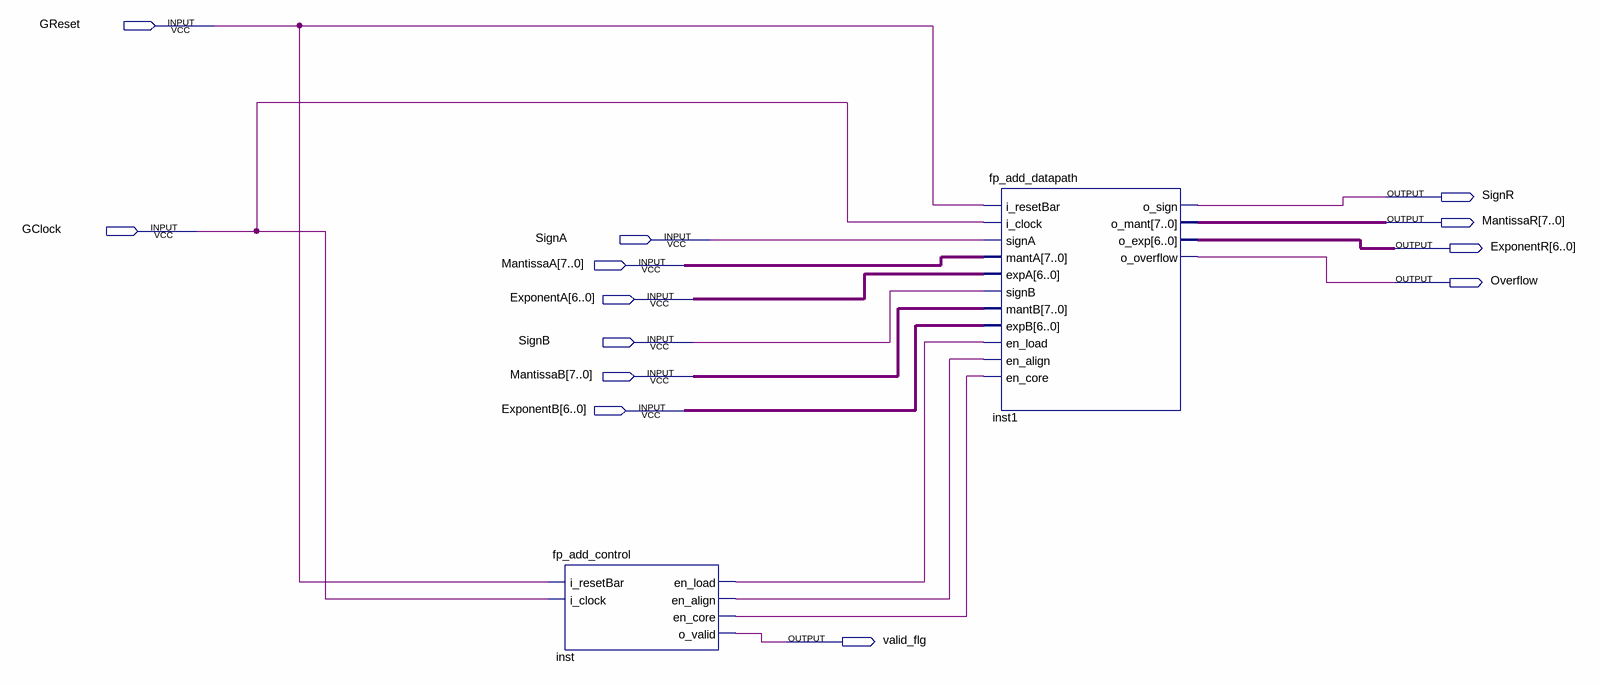
[diagram p0: schematic sheet]
// Quartus schematic top_level.bdf as structural Verilog: 2 symbols, 13 pins
module top_level (
  input  GReset,
  input  GClock,
  input  SignA,
  input  [7:0] MantissaA,
  input  [6:0] ExponentA,
  input  SignB,
  input  [7:0] MantissaB,
  input  [6:0] ExponentB,
  output SignR,
  output [7:0] MantissaR,
  output [6:0] ExponentR,
  output Overflow,
  output valid_flg
);

  wire inst_en_align, inst_en_core, inst_en_load;

  fp_add_control inst (
    .i_resetBar(GReset), .i_clock(GClock), .en_load(inst_en_load), .en_align(inst_en_align),
    .en_core(inst_en_core), .o_valid(valid_flg));
  fp_add_datapath inst1 (
    .i_resetBar(GReset), .i_clock(GClock), .signA(SignA), .mantA(MantissaA), .expA(ExponentA), .signB(SignB),
    .mantB(MantissaB), .expB(ExponentB), .en_load(inst_en_load), .en_align(inst_en_align),
    .en_core(inst_en_core), .o_sign(SignR), .o_mant(MantissaR), .o_exp(ExponentR), .o_overflow(Overflow));
endmodule
